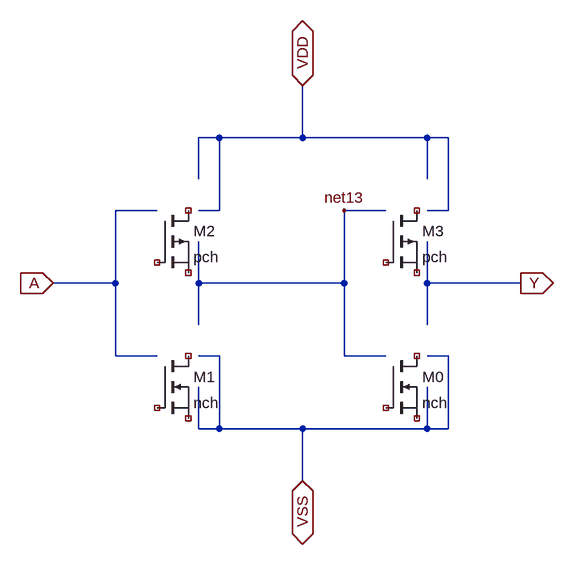
[diagram p0: schematic buf1.asc]
buf1.asc, the LTspice schematic file:
Version 4
SHEET 1 896 800
WIRE 96 400 192 400
WIRE 192 400 192 288
WIRE 192 288 256 288
WIRE 192 512 256 512
WIRE 192 512 192 400
WIRE 544 512 544 400
WIRE 544 288 608 288
WIRE 320 464 320 400
WIRE 544 512 608 512
WIRE 544 400 544 288
WIRE 320 400 544 400
WIRE 320 400 320 336
WIRE 672 400 816 400
WIRE 672 400 672 336
WIRE 672 464 672 400
WIRE 480 624 480 704
WIRE 480 624 672 624
WIRE 352 624 352 512
WIRE 352 624 480 624
WIRE 320 512 352 512
WIRE 672 624 704 624
WIRE 704 624 704 512
WIRE 672 512 704 512
WIRE 672 624 672 560
WIRE 320 624 352 624
WIRE 320 624 320 560
WIRE 480 96 480 176
WIRE 480 176 672 176
WIRE 672 176 704 176
WIRE 704 288 704 176
WIRE 672 288 704 288
WIRE 352 288 352 176
WIRE 352 176 480 176
WIRE 320 288 352 288
WIRE 672 240 672 176
WIRE 320 176 352 176
WIRE 320 240 320 176
FLAG 544 288 net13
SYMBOL PMOS 608 288 R0
SYMATTR InstName M3
SYMATTR Value pch
SYMATTR Value2 w=6u l=1u
SYMBOL PMOS 256 288 R0
SYMATTR InstName M2
SYMATTR Value pch
SYMATTR Value2 w=6u l=1u
SYMBOL NMOS 256 512 R0
SYMATTR InstName M1
SYMATTR Value nch
SYMATTR Value2 w=2u l=1u
SYMBOL NMOS 608 512 R0
SYMATTR InstName M0
SYMATTR Value nch
SYMATTR Value2 w=2u l=1u
FLAG 816 400 Y
IOPIN 816 400 Out
FLAG 480 704 VSS
IOPIN 480 704 BiDir
FLAG 480 96 VDD
IOPIN 480 96 BiDir
FLAG 96 400 A
IOPIN 96 400 In

The netlist it stands for:
* buf1.asc
* M3: pch w=6u l=1u (symbol PMOS not certain, pin order unknown); nets seen at it: 
* M2: pch w=6u l=1u (symbol PMOS not certain, pin order unknown); nets seen at it: 
* M1: nch w=2u l=1u (symbol NMOS not certain, pin order unknown); nets seen at it: 
* M0: nch w=2u l=1u (symbol NMOS not certain, pin order unknown); nets seen at it: 
.backanno
.end